# Altium project braking_io.PrjPcb (part 3 of 5)

## Sheet power_24V.SchDoc: Power 24V
size A4; Organization: Badgerloop Electrical; Address1: 133 Engineering Research Building; Address2: 1500 Engineering Drive; Address3: Madison, Wi 53706
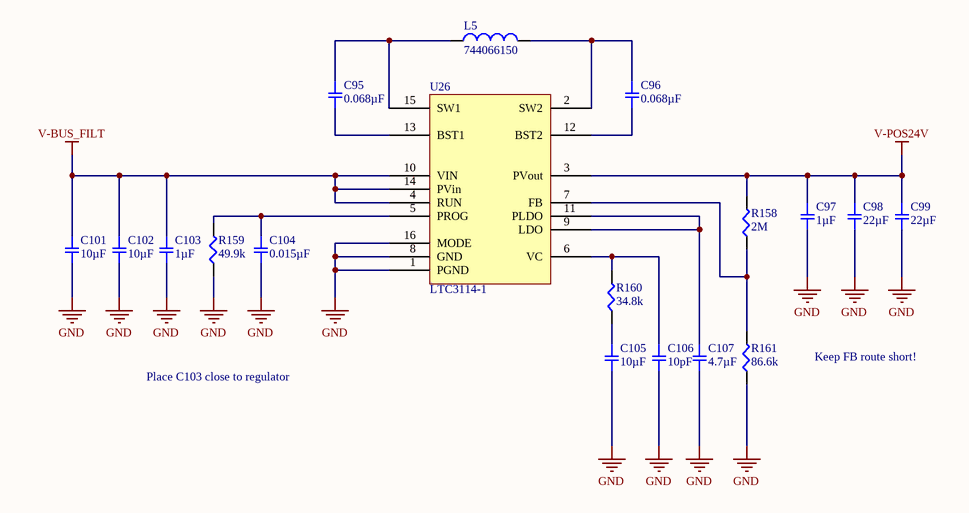
[diagram p5: power_24V.SchDoc]

### Parts
C95  0.068µF  [SMD-0805C]
C96  0.068µF  [SMD-0805C]
C97  1µF  [SMD-0805C]
C98  22µF  [SMD-1206C]
C99  22µF  [SMD-1206C]
C101  10µF  [SMD-1206C]
C102  10µF  [SMD-1206C]
C103  1µF  [SMD-1206C]
C104  0.015µF  [SMD-0805C]
C105  10µF  [SMD-1206C]
C106  10pF  [SMD-0805C]
C107  4.7µF  [SMD-1206C]
L5  744066150  [INDP100100X38N]
R158  2M  [SMD-0805-RES]
R159  49.9k  [SMD-0805-RES]
R160  34.8k  [SMD-0805-RES]
R161  86.6k  [SMD-0805-RES]
U26  LTC3114-1  [TSOP65P640X110_HS-17N]

### Nets
GND: C97.2 C98.2 C99.2 C101.2 C102.2 C103.2 C104.2 C105.2 C106.2 C107.2 R159.1 R161.1 U26.1(PGND) U26.8(GND) U26.16(MODE)
V-BUS_FILT: C101.1 C102.1 C103.1 U26.4(RUN) U26.10(VIN) U26.14(PVin)
V-POS24V: C97.1 C98.1 C99.1 R158.2 U26.3(PVout)
NetC95_1: C95.1 L5.1 U26.15(SW1)
NetC95_2: C95.2 U26.13(BST1)
NetC96_1: C96.1 L5.2 U26.2(SW2)
NetC96_2: C96.2 U26.12(BST2)
NetC104_1: C104.1 R159.2 U26.5(PROG)
NetC105_1: C105.1 R160.1
NetC106_1: C106.1 R160.2 U26.6(VC)
NetC107_1: C107.1 U26.9(LDO) U26.11(PLDO)
NetR158_1: R158.1 R161.2 U26.7(FB)

### Notes on the sheet
- Place C103 close to regulator
- Keep FB route short!
- Title
- Engineer:
- Date:
- Time:
- Revision:
- Sheet
- of
- File:

### Library data of the parts
C95 C96 = GCJ21BR71H683KA01L: CAP CER 0.068UF 50V X7R 0805; Manufacturer: Murata Electronics North America; Factory Stock: 0; Unit Price (USD): 0.24; Minimum Quantity: 1; Tolerance: ±10%; Datasheets: http://www.murata.com/~/media/webrenewal/support/library/catalog/products/capacitor/mlcc/c03e.ashx; Image: //media.digikey.com/Renders/Murata%20Renders/0805%20(2012%20Metric)%20.85mm.jpg; Digi-Key Part Number: 490-5807-1-ND; Part Number: GCJ21BR71H683KA01L; Quantity Available: 4490; @ qty: 0; Packaging: Cut Tape (CT); Series: GCJ; Part Status: Active; Value: 0.068µF; Voltage: 50V; Temperature Coefficient: X7R; Operating Temperature: -55°C ~ 125°C; Features: Soft Termination; Ratings: AEC-Q200; Applications: Automotive, Boardflex Sensitive; Mounting Type: Surface Mount, MLCC; Package / Case: 0805 (2012 Metric); Size / Dimension: 0.079" L x 0.049" W (2.00mm x 1.25mm); Height - Seated (Max): -; Thickness (Max): 0.057" (1.45mm); Lead Spacing: -; Lead Style: -
C97 = GCJ21BR71H105KA01L: CAP CER 1UF 50V X7R 0805; Manufacturer: Murata Electronics North America; Factory Stock: 0; Unit Price (USD): 0.33; Minimum Quantity: 1; Tolerance: ±10%; Datasheets: http://www.murata.com/~/media/webrenewal/support/library/catalog/products/capacitor/mlcc/c03e.ashx; Image: //media.digikey.com/Renders/Murata%20Renders/0805%20(2012%20Metric)%20.85mm.jpg; Digi-Key Part Number: 490-10667-1-ND; Part Number: GCJ21BR71H105KA01L; Quantity Available: 55137; @ qty: 0; Packaging: Cut Tape (CT); Series: GCJ; Part Status: Active; Value: 1µF; Voltage: 50V; Temperature Coefficient: X7R; Operating Temperature: -55°C ~ 125°C; Features: Soft Termination; Ratings: AEC-Q200; Applications: Automotive, Boardflex Sensitive; Mounting Type: Surface Mount, MLCC; Package / Case: 0805 (2012 Metric); Size / Dimension: 0.079" L x 0.049" W (2.00mm x 1.25mm); Height - Seated (Max): -; Thickness (Max): 0.057" (1.45mm); Lead Spacing: -; Lead Style: -
C98 C99 = GRM31CR61E226KE15L: CAP CER 22UF 25V X5R 1206; Manufacturer: Murata Electronics North America; Factory Stock: 0; Unit Price (USD): 0.56; Minimum Quantity: 1; Tolerance: ±10%; Datasheets: http://www.murata.com/~/media/webrenewal/support/library/catalog/products/capacitor/mlcc/c02e.pdf; Image: //media.digikey.com/Renders/Murata%20Renders/GR331BD72E473KW01L.jpg; Digi-Key Part Number: 490-5527-1-ND; Part Number: GRM31CR61E226KE15L; Quantity Available: 524412; @ qty: 0; Packaging: Cut Tape (CT); Series: GRM; Part Status: Active; Value: 22µF; Voltage: 25V; Temperature Coefficient: X5R; Operating Temperature: -55°C ~ 85°C; Features: -; Ratings: -; Applications: General Purpose; Mounting Type: Surface Mount, MLCC; Package / Case: 1206 (3216 Metric); Size / Dimension: 0.126" L x 0.063" W (3.20mm x 1.60mm); Height - Seated (Max): -; Thickness (Max): 0.071" (1.80mm); Lead Spacing: -; Lead Style: -
C101 C102 C105 = GRM31CR61H106KA12L: CAP CER 10UF 50V X5R 1206; Manufacturer: Murata Electronics North America; Factory Stock: 0; Unit Price (USD): 0.65; Minimum Quantity: 1; Tolerance: ±10%; Datasheets: http://www.murata.com/~/media/webrenewal/support/library/catalog/products/capacitor/mlcc/c02e.pdf; Image: //media.digikey.com/Renders/Murata%20Renders/GR331BD72E473KW01L.jpg; Digi-Key Part Number: 490-5961-1-ND; Part Number: GRM31CR61H106KA12L; Quantity Available: 86736; @ qty: 0; Packaging: Cut Tape (CT); Series: GRM; Part Status: Active; Value: 10µF; Voltage: 50V; Temperature Coefficient: X5R; Operating Temperature: -55°C ~ 85°C; Features: -; Ratings: -; Applications: General Purpose; Mounting Type: Surface Mount, MLCC; Package / Case: 1206 (3216 Metric); Size / Dimension: 0.126" L x 0.063" W (3.20mm x 1.60mm); Height - Seated (Max): -; Thickness (Max): 0.071" (1.80mm); Lead Spacing: -; Lead Style: -
C103 = GCJ31MR71H105KA12L: CAP CER 1UF 50V X7R 1206; Manufacturer: Murata Electronics North America; Factory Stock: 0; Unit Price (USD): 0.32; Minimum Quantity: 1; Tolerance: ±10%; Datasheets: http://www.murata.com/~/media/webrenewal/support/library/catalog/products/capacitor/mlcc/c03e.ashx; Image: //media.digikey.com/Renders/Murata%20Renders/GR331BD72E473KW01L.jpg; Digi-Key Part Number: 490-5810-1-ND; Part Number: GCJ31MR71H105KA12L; Quantity Available: 38710; @ qty: 0; Packaging: Cut Tape (CT); Series: GCJ; Part Status: Active; Value: 1µF; Voltage: 50V; Temperature Coefficient: X7R; Operating Temperature: -55°C ~ 125°C; Features: Soft Termination; Ratings: AEC-Q200; Applications: Automotive, Boardflex Sensitive; Mounting Type: Surface Mount, MLCC; Package / Case: 1206 (3216 Metric); Size / Dimension: 0.126" L x 0.063" W (3.20mm x 1.60mm); Height - Seated (Max): -; Thickness (Max): 0.053" (1.35mm); Lead Spacing: -; Lead Style: -
C104 = GC321AD72E153KX01D: CAP CER 0.015UF 250V X7T 0805; Manufacturer: Murata Electronics North America; Factory Stock: 0; Unit Price (USD): 0.27; Minimum Quantity: 1; Tolerance: ±10%; Datasheets: http://search.murata.co.jp/Ceramy/image/img/A01X/G101/ENG/GC321AD72E153KX01-01.pdf; Image: //media.digikey.com/Renders/Murata%20Renders/0805(GC3)200x125.jpg; Digi-Key Part Number: 490-13987-1-ND; Part Number: GC321AD72E153KX01D; Quantity Available: 4000; @ qty: 0; Packaging: Cut Tape (CT); Series: GC3; Part Status: Active; Value: 0.015µF; Voltage: 250V; Temperature Coefficient: X7T; Operating Temperature: -55°C ~ 125°C; Features: -; Ratings: AEC-Q200; Applications: Automotive; Mounting Type: Surface Mount, MLCC; Package / Case: 0805 (2012 Metric); Size / Dimension: 0.079" L x 0.049" W (2.00mm x 1.25mm); Height - Seated (Max): -; Thickness (Max): 0.039" (1.00mm); Lead Spacing: -; Lead Style: -
C106 = GQM2195C2A100GB01D: CAP CER 10PF 100V NP0 0805; Manufacturer: Murata Electronics North America; Factory Stock: 0; Unit Price (USD): 0.91; Minimum Quantity: 1; Tolerance: ±2%; Temperature Coefficient: C0G, NP0; Datasheets: http://www.murata.com/~/media/webrenewal/support/library/catalog/products/capacitor/mlcc/c02e.pdf; Image: //media.digikey.com/Renders/Murata%20Renders/0805(GxM9).jpg; Digi-Key Part Number: 490-6098-1-ND; Part Number: GQM2195C2A100GB01D; Quantity Available: 3211; @ qty: 0; Packaging: Cut Tape (CT); Series: GQM; Part Status: Active; Value: 10pF; Voltage: 100V; Operating Temperature: -55°C ~ 125°C; Features: High Q, Low Loss; Ratings: -; Applications: RF, Microwave, High Frequency; Mounting Type: Surface Mount, MLCC; Package / Case: 0805 (2012 Metric); Size / Dimension: 0.079" L x 0.049" W (2.00mm x 1.25mm); Height - Seated (Max): -; Thickness (Max): 0.037" (0.95mm); Lead Spacing: -; Lead Style: -
C107 = GCM31CC71H475KA03L: CAP CER 4.7UF 50V X7S 1206; Manufacturer: Murata Electronics North America; Factory Stock: 0; Unit Price (USD): 0.57; Minimum Quantity: 1; Tolerance: ±10%; Datasheets: http://www.murata.com/~/media/webrenewal/support/library/catalog/products/capacitor/mlcc/c03e.ashx; Image: //media.digikey.com/Renders/Murata%20Renders/GR331BD72E473KW01L.jpg; Digi-Key Part Number: 490-11167-1-ND; Part Number: GCM31CC71H475KA03L; Quantity Available: 11700; @ qty: 0; Packaging: Cut Tape (CT); Series: GCM; Part Status: Active; Value: 4.7µF; Voltage: 50V; Temperature Coefficient: X7S; Operating Temperature: -55°C ~ 125°C; Features: -; Ratings: AEC-Q200; Applications: Automotive; Mounting Type: Surface Mount, MLCC; Package / Case: 1206 (3216 Metric); Size / Dimension: 0.126" L x 0.063" W (3.20mm x 1.60mm); Height - Seated (Max): -; Thickness (Max): 0.071" (1.80mm); Lead Spacing: -; Lead Style: -
L5 = 744066150: FIXED IND 15UH 3.2A 50 MOHM SMD; Manufacturer: Wurth Electronics; Core Material: Ferrite; Saturation Current: 3.25A; Tolerance: 30%; Shielding: Shielded; Self Resonant Frequency: 16MHz; DC Resistance (DCR): 50mR; Test Frequency: 100kHz; Supplier 1: Digi-Key; Manufacturer Part Number: 744066150; Stock 1: 1755; Pricing 1: 1=1.94000, 10=1.88200, 50=1.64600, 100=1.50500 (USD); RoHS: Yes; Mount: Surface Mount; Case/Package: Nonstandard; Weight: 0.044904oz; Min Operating Temperature: -40°C; Max Operating Temperature: 125°C; Package Quantity: 800; Current Rating: 3.2A; Packaging: Cut Tape; Inductance Tolerance: 30%; Inductance: 15uH; Composition: Wirewound; Max DC Current: 3.2A; Termination: SMD/SMT; RMS Current (Irms): 3.2A; Series Resistance: 50mR; Length: 10mm; Height: 3.8mm; Width: 10mm; Height - Seated (Max): 0.161inch; Depth: 10mm; REACH SVHC: Unknown; Lead Free: Lead Free; ComponentLink1URL: https://datasheet.ciiva.com/1051/744066150-1051985.pdf?src-supplier=Digi-Key; ComponentLink1Description: https://datasheet.ciiva.com/1051/744066150-1051985.pdf?src-supplier=Digi-Key; ComponentLink2URL: https://datasheet.ciiva.com/7892/1735619-7892648.pdf?src-supplier=Element14; ComponentLink2Description: https://datasheet.ciiva.com/7892/1735619-7892648.pdf?src-supplier=Element14; ComponentLink3URL: https://datasheet.ciiva.com/11803/0900766b80febc54-11803273.pdf?src-supplier=RSComponents; ComponentLink3Description: https://datasheet.ciiva.com/11803/0900766b80febc54-11803273.pdf?src-supplier=RSComponents; ComponentLink4URL: https://datasheet.ciiva.com/13320/744066150-67363-13320654.pdf?src-supplier=Mouser; ComponentLink4Description: https://datasheet.ciiva.com/13320/744066150-67363-13320654.pdf?src-supplier=Mouser; ComponentLink5URL: https://datasheet.ciiva.com/1051/744066150-1051986.pdf?src-supplier=Digi-Key; ComponentLink5Description: https://datasheet.ciiva.com/1051/744066150-1051986.pdf?src-supplier=Digi-Key; ComponentLink6URL: https://datasheet.ciiva.com/1051/744066150-1051987.pdf?src-supplier=Digi-Key; ComponentLink6Description: https://datasheet.ciiva.com/1051/744066150-1051987.pdf?src-supplier=Digi-Key; ComponentLink7URL: https://datasheet.ciiva.com/14123/744066150-ch-ger-eng-ds-14123723.pdf?src-supplier=Distrelec; ComponentLink7Description: https://datasheet.ciiva.com/14123/744066150-ch-ger-eng-ds-14123723.pdf?src-supplier=Distrelec; Supplier Part Number 1: 732-1077-1-ND
R158 = ERJ-6ENF2004V: RES SMD 2M OHM 1% 1/8W 0805; Manufacturer: Panasonic Electronic Components; Factory Stock: 0; Unit Price (USD): 0.00729; @ qty: 1500; Minimum Quantity: 1; Power (Watts): 0.125W, 1/8W; Temperature Coefficient: ±100ppm/°C; Part Number: ERJ-6ENF2004V; Datasheets: http://industrial.panasonic.com/www-cgi/jvcr13pz.cgi?E+PZ+3+AOA0002+ERJ6ENF2004V+7+WW; Image: //media.digikey.com/Renders/Panasonic%20Renders/ERJ-0805%20Pkg.jpg; Digi-Key Part Number: P2.00MCCT-ND; Quantity Available: 31894; Packaging: Cut Tape (CT); Series: ERJ; Part Status: Active; Value: 2M; Tolerance: ±1%; Composition: Thick Film; Features: Automotive AEC-Q200; Operating Temperature: -55°C ~ 155°C; Package / Case: 0805 (2012 Metric); Supplier Device Package: 0805; Size / Dimension: 0.079" L x 0.049" W (2.00mm x 1.25mm); Height - Seated (Max): 0.028" (0.70mm); Number of Terminations: 2; Failure Rate: -
R159 = ERJ-6ENF4992V: RES SMD 49.9K OHM 1% 1/8W 0805; Manufacturer: Panasonic Electronic Components; Factory Stock: 0; Unit Price (USD): 0.00729; @ qty: 1500; Minimum Quantity: 1; Power (Watts): 0.125W, 1/8W; Temperature Coefficient: ±100ppm/°C; Part Number: ERJ-6ENF4992V; Datasheets: http://industrial.panasonic.com/www-cgi/jvcr13pz.cgi?E+PZ+3+AOA0002+ERJ6ENF4992V+7+WW; Image: //media.digikey.com/Renders/Panasonic%20Renders/ERJ-0805%20Pkg.jpg; Digi-Key Part Number: P49.9KCCT-ND; Quantity Available: 165139; Packaging: Cut Tape (CT); Series: ERJ; Part Status: Active; Value: 49.9k; Tolerance: ±1%; Composition: Thick Film; Features: Automotive AEC-Q200; Operating Temperature: -55°C ~ 155°C; Package / Case: 0805 (2012 Metric); Supplier Device Package: 0805; Size / Dimension: 0.079" L x 0.049" W (2.00mm x 1.25mm); Height - Seated (Max): 0.028" (0.70mm); Number of Terminations: 2; Failure Rate: -
R160 = ERJ-6ENF3482V: RES SMD 34.8K OHM 1% 1/8W 0805; Manufacturer: Panasonic Electronic Components; Factory Stock: 0; Unit Price (USD): 0.00729; @ qty: 1500; Minimum Quantity: 1; Power (Watts): 0.125W, 1/8W; Temperature Coefficient: ±100ppm/°C; Part Number: ERJ-6ENF3482V; Datasheets: http://industrial.panasonic.com/www-cgi/jvcr13pz.cgi?E+PZ+3+AOA0002+ERJ6ENF3482V+7+WW; Image: //media.digikey.com/Renders/Panasonic%20Renders/ERJ-0805%20Pkg.jpg; Digi-Key Part Number: P34.8KCCT-ND; Quantity Available: 31955; Packaging: Cut Tape (CT); Series: ERJ; Part Status: Active; Value: 34.8k; Tolerance: ±1%; Composition: Thick Film; Features: Automotive AEC-Q200; Operating Temperature: -55°C ~ 155°C; Package / Case: 0805 (2012 Metric); Supplier Device Package: 0805; Size / Dimension: 0.079" L x 0.049" W (2.00mm x 1.25mm); Height - Seated (Max): 0.028" (0.70mm); Number of Terminations: 2; Failure Rate: -
R161 = ERJ-6ENF8662V: RES SMD 86.6K OHM 1% 1/8W 0805; Manufacturer: Panasonic Electronic Components; Factory Stock: 0; Unit Price (USD): 0.00729; @ qty: 1500; Minimum Quantity: 1; Power (Watts): 0.125W, 1/8W; Temperature Coefficient: ±100ppm/°C; Part Number: ERJ-6ENF8662V; Datasheets: http://industrial.panasonic.com/www-cgi/jvcr13pz.cgi?E+PZ+3+AOA0002+ERJ6ENF8662V+7+WW; Image: //media.digikey.com/Renders/Panasonic%20Renders/ERJ-0805%20Pkg.jpg; Digi-Key Part Number: P86.6KCCT-ND; Quantity Available: 23872; Packaging: Cut Tape (CT); Series: ERJ; Part Status: Active; Value: 86.6k; Tolerance: ±1%; Composition: Thick Film; Features: Automotive AEC-Q200; Operating Temperature: -55°C ~ 155°C; Package / Case: 0805 (2012 Metric); Supplier Device Package: 0805; Size / Dimension: 0.079" L x 0.049" W (2.00mm x 1.25mm); Height - Seated (Max): 0.028" (0.70mm); Number of Terminations: 2; Failure Rate: -
U26 = LTC3114-1: Manufacturer: Analog Devices / Linear Technology; Manufacturer Part Number: LTC3114EFE-1#TRPBF; Number of Outputs: 1; Min Input Voltage: 2.2V; Max Input Voltage: 40V; Min Output Voltage: 2.7V; Output Current: 1A; Switching Frequency: 1.2MHz; Synchronous Rectifier: Yes; Efficiency: 96%; Topology: Buck-Boost; Output Type: Adjustable; Output Configuration: Positive; Supplier 1: Digi-Key; Stock 1: 2151; Pricing 1: 1=10.01000, 25=7.35000, 100=5.49400, 250=5.21932, 500=5.10160 (USD); RoHS: Yes; Mount: Surface Mount; Case/Package: TSSOP; Number of Pins: 16; Min Operating Temperature: -40°C; Max Operating Temperature: 125°C; Packaging: Tape and Reel; Max Output Voltage: 40V; Output Voltage: 2.7V; ComponentLink1URL: http://components.arrow.com/part/dataview/66446920S858405N7433?src-supplier=Arrow; ComponentLink1Description: http://components.arrow.com/part/dataview/66446920S858405N7433?src-supplier=Arrow; ComponentLink2URL: http://www.linear.com/docs/44756?src-supplier=Digi-Key; ComponentLink2Description: http://www.linear.com/docs/44756?src-supplier=Digi-Key; Supplier Part Number 1: LTC3114EFE-1#TRPBFCT-ND

## Sheet solenoid.SchDoc: Solenoids
size A4; Organization: Badgerloop Electrical; Address1: 133 Engineering Research Building; Address2: 1500 Engineering Drive; Address3: Madison, Wi 53706
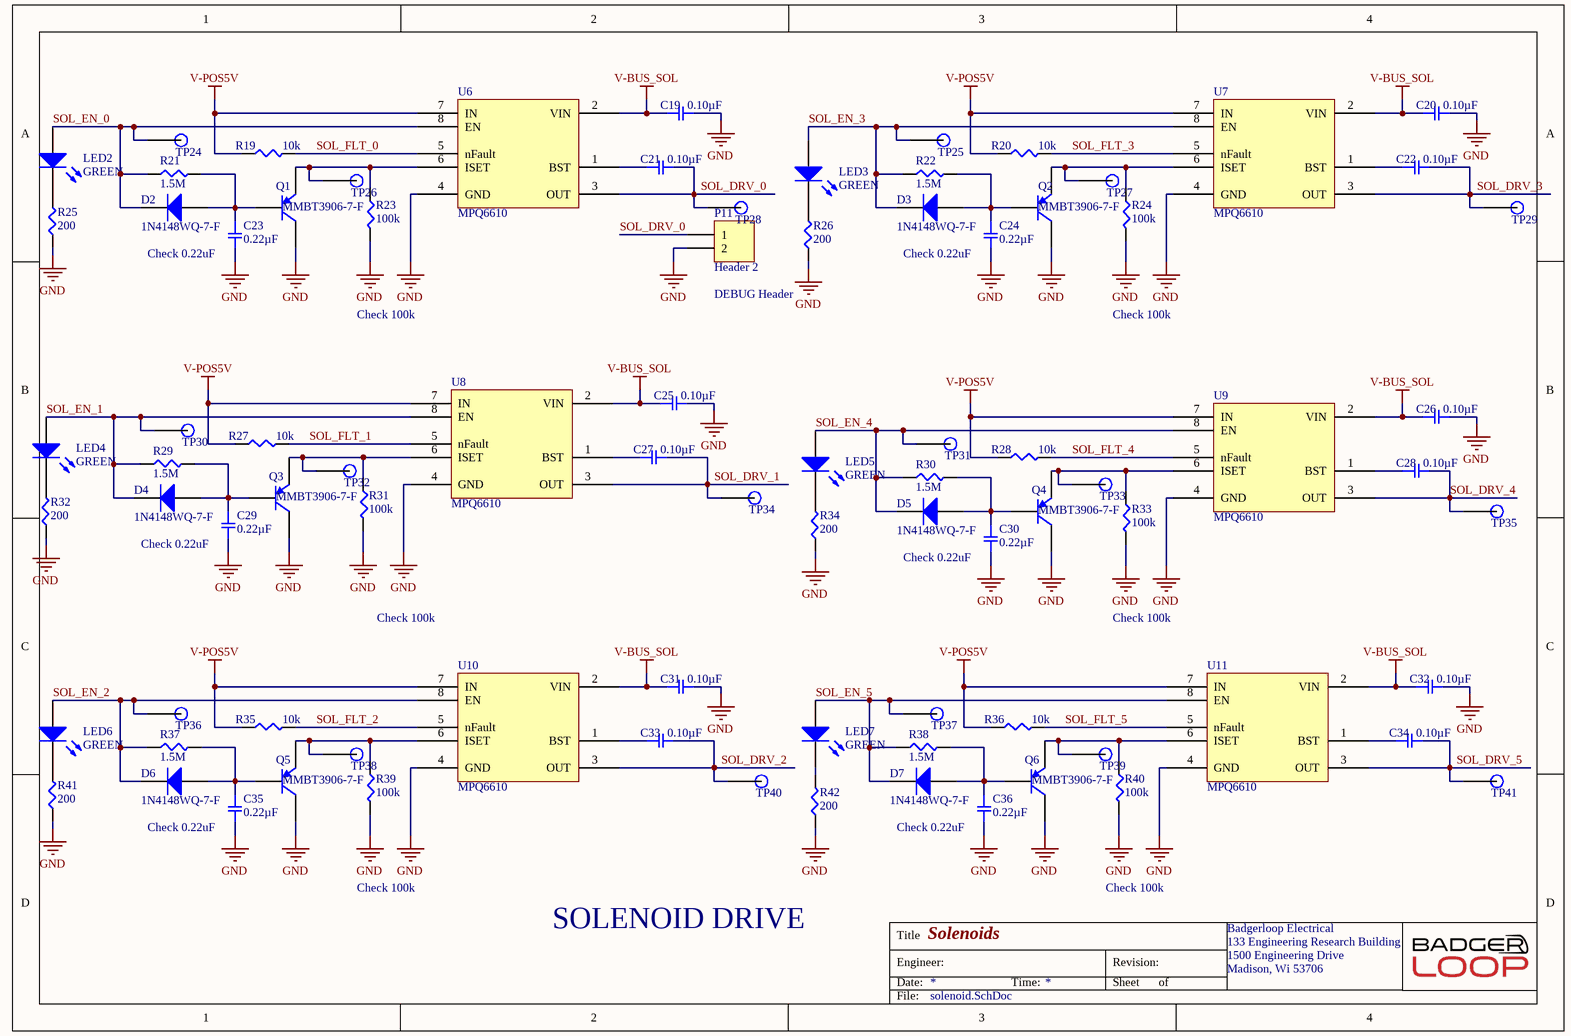
[diagram p6: solenoid.SchDoc]

### Parts
C19  0.10µF  [SMD-0805C]
C20  0.10µF  [SMD-0805C]
C21  0.10µF  [SMD-0805C]
C22  0.10µF  [SMD-0805C]
C23  0.22µF  [SMD-0805C]
C24  0.22µF  [SMD-0805C]
C25  0.10µF  [SMD-0805C]
C26  0.10µF  [SMD-0805C]
C27  0.10µF  [SMD-0805C]
C28  0.10µF  [SMD-0805C]
C29  0.22µF  [SMD-0805C]
C30  0.22µF  [SMD-0805C]
C31  0.10µF  [SMD-0805C]
C32  0.10µF  [SMD-0805C]
C33  0.10µF  [SMD-0805C]
C34  0.10µF  [SMD-0805C]
C35  0.22µF  [SMD-0805C]
C36  0.22µF  [SMD-0805C]
D2  1N4148WQ-7-F  [INDM3838X18N]
D3  1N4148WQ-7-F  [INDM3838X18N]
D4  1N4148WQ-7-F  [INDM3838X18N]
D5  1N4148WQ-7-F  [INDM3838X18N]
D6  1N4148WQ-7-F  [INDM3838X18N]
D7  1N4148WQ-7-F  [INDM3838X18N]
LED2  GREEN  [LED 0603 GREEN]
LED3  GREEN  [LED 0603 GREEN]
LED4  GREEN  [LED 0603 GREEN]
LED5  GREEN  [LED 0603 GREEN]
LED6  GREEN  [LED 0603 GREEN]
LED7  GREEN  [LED 0603 GREEN]
P11  Header 2  [Pin Header 1x2 TH Pitch 2.54mm]
Q1  MMBT3906-7-F  [SOTFL103P240X110-3N]
Q2  MMBT3906-7-F  [SOTFL103P240X110-3N]
Q3  MMBT3906-7-F  [SOTFL103P240X110-3N]
Q4  MMBT3906-7-F  [SOTFL103P240X110-3N]
Q5  MMBT3906-7-F  [SOTFL103P240X110-3N]
Q6  MMBT3906-7-F  [SOTFL103P240X110-3N]
R19  10k  [SMD-0805-RES]
R20  10k  [SMD-0805-RES]
R21  1.5M  [SMD-0805-RES]
R22  1.5M  [SMD-0805-RES]
R23  100k  [SMD-0805-RES]
R24  100k  [SMD-0805-RES]
R25  200  [SMD-0805-RES]
R26  200  [SMD-0805-RES]
R27  10k  [SMD-0805-RES]
R28  10k  [SMD-0805-RES]
R29  1.5M  [SMD-0805-RES]
R30  1.5M  [SMD-0805-RES]
R31  100k  [SMD-0805-RES]
R32  200  [SMD-0805-RES]
R33  100k  [SMD-0805-RES]
R34  200  [SMD-0805-RES]
R35  10k  [SMD-0805-RES]
R36  10k  [SMD-0805-RES]
R37  1.5M  [SMD-0805-RES]
R38  1.5M  [SMD-0805-RES]
R39  100k  [SMD-0805-RES]
R40  100k  [SMD-0805-RES]
R41  200  [SMD-0805-RES]
R42  200  [SMD-0805-RES]
TP24  TP  [Test Point]  (value not drawn)
TP25  TP  [Test Point]  (value not drawn)
TP26  TP  [Test Point]  (value not drawn)
TP27  TP  [Test Point]  (value not drawn)
TP28  TP  [Test Point]  (value not drawn)
TP29  TP  [Test Point]  (value not drawn)
TP30  TP  [Test Point]  (value not drawn)
TP31  TP  [Test Point]  (value not drawn)
TP32  TP  [Test Point]  (value not drawn)
TP33  TP  [Test Point]  (value not drawn)
TP34  TP  [Test Point]  (value not drawn)
TP35  TP  [Test Point]  (value not drawn)
TP36  TP  [Test Point]  (value not drawn)
TP37  TP  [Test Point]  (value not drawn)
TP38  TP  [Test Point]  (value not drawn)
TP39  TP  [Test Point]  (value not drawn)
TP40  TP  [Test Point]  (value not drawn)
TP41  TP  [Test Point]  (value not drawn)
U6  MPQ6610  [SOP127P600X175-8N]
U7  MPQ6610  [SOP127P600X175-8N]
U8  MPQ6610  [SOP127P600X175-8N]
U9  MPQ6610  [SOP127P600X175-8N]
U10  MPQ6610  [SOP127P600X175-8N]
U11  MPQ6610  [SOP127P600X175-8N]

### Nets
GND: C19.2 C20.2 C23.2 C24.2 C25.2 C26.2 C29.2 C30.2 C31.2 C32.2 C35.2 C36.2 P11.2 Q1.3(C) Q2.3(C) Q3.3(C) Q4.3(C) Q5.3(C) Q6.3(C) R23.2 R24.2 R25.1 R26.1 R31.2 R32.1 R33.2 R34.1 R39.2 R40.2 R41.1 R42.1 U6.4(GND) U7.4(GND) U8.4(GND) U9.4(GND) U10.4(GND) U11.4(GND)
V-BUS_SOL: C19.1 C20.1 C25.1 C26.1 C31.1 C32.1 U6.2(VIN) U7.2(VIN) U8.2(VIN) U9.2(VIN) U10.2(VIN) U11.2(VIN)
V-POS5V: R19.1 R20.1 R27.1 R28.1 R35.1 R36.1 U6.7(IN) U7.7(IN) U8.7(IN) U9.7(IN) U10.7(IN) U11.7(IN)
SOL_DRV_0: C21.2 P11.1 TP28.1 U6.3(OUT)
SOL_DRV_1: C27.2 TP34.1 U8.3(OUT)
SOL_DRV_2: C33.2 TP40.1 U10.3(OUT)
SOL_DRV_3: C22.2 TP29.1 U7.3(OUT)
SOL_DRV_4: C28.2 TP35.1 U9.3(OUT)
SOL_DRV_5: C34.2 TP41.1 U11.3(OUT)
SOL_EN_0: D2.2(K) LED2.1(A) R21.1 TP24.1 U6.8(EN)
SOL_EN_1: D4.2(K) LED4.1(A) R29.1 TP30.1 U8.8(EN)
SOL_EN_2: D6.2(K) LED6.1(A) R37.1 TP36.1 U10.8(EN)
SOL_EN_3: D3.2(K) LED3.1(A) R22.1 TP25.1 U7.8(EN)
SOL_EN_4: D5.2(K) LED5.1(A) R30.1 TP31.1 U9.8(EN)
SOL_EN_5: D7.2(K) LED7.1(A) R38.1 TP37.1 U11.8(EN)
SOL_FLT_0: R19.2 U6.5(nFault)
SOL_FLT_1: R27.2 U8.5(nFault)
SOL_FLT_2: R35.2 U10.5(nFault)
SOL_FLT_3: R20.2 U7.5(nFault)
SOL_FLT_4: R28.2 U9.5(nFault)
SOL_FLT_5: R36.2 U11.5(nFault)
NetC21_1: C21.1 U6.1(BST)
NetC22_1: C22.1 U7.1(BST)
NetC23_1: C23.1 D2.1(A) Q1.1(B) R21.2
NetC24_1: C24.1 D3.1(A) Q2.1(B) R22.2
NetC27_1: C27.1 U8.1(BST)
NetC28_1: C28.1 U9.1(BST)
NetC29_1: C29.1 D4.1(A) Q3.1(B) R29.2
NetC30_1: C30.1 D5.1(A) Q4.1(B) R30.2
NetC33_1: C33.1 U10.1(BST)
NetC34_1: C34.1 U11.1(BST)
NetC35_1: C35.1 D6.1(A) Q5.1(B) R37.2
NetC36_1: C36.1 D7.1(A) Q6.1(B) R38.2
NetLED2_2: LED2.2(K) R25.2
NetLED3_2: LED3.2(K) R26.2
NetLED4_2: LED4.2(K) R32.2
NetLED5_2: LED5.2(K) R34.2
NetLED6_2: LED6.2(K) R41.2
NetLED7_2: LED7.2(K) R42.2
NetQ1_2: Q1.2(E) R23.1 TP26.1 U6.6(ISET)
NetQ2_2: Q2.2(E) R24.1 TP27.1 U7.6(ISET)
NetQ3_2: Q3.2(E) R31.1 TP32.1 U8.6(ISET)
NetQ4_2: Q4.2(E) R33.1 TP33.1 U9.6(ISET)
NetQ5_2: Q5.2(E) R39.1 TP38.1 U10.6(ISET)
NetQ6_2: Q6.2(E) R40.1 TP39.1 U11.6(ISET)

### Notes on the sheet
- (near C23) Check 0.22uF
- DEBUG Header
- (near C24) Check 0.22uF
- Check 100k
- (near C29) Check 0.22uF
- (near C30) Check 0.22uF
- (near C35) Check 0.22uF
- (near C36) Check 0.22uF
- SOLENOID DRIVE
- Title
- Engineer:
- Date:
- Time:
- Revision:
- Sheet
- of
- File:

### Library data of the parts
C19-C22 C25-C28 C31-C34 = GRM21B7U1A104JA01L: CAP CER 0.1UF 10V U2J 0805; Manufacturer: Murata Electronics North America; Factory Stock: 0; Unit Price (USD): 0.4; Minimum Quantity: 1; Tolerance: ±5%; Datasheets: http://www.murata.com/~/media/webrenewal/support/library/catalog/products/capacitor/mlcc/c02e.pdf; Image: //media.digikey.com/Renders/Murata%20Renders/0805%20(2012%20Metric)%20.85mm.jpg; Digi-Key Part Number: 490-11592-1-ND; Part Number: GRM21B7U1A104JA01L; Quantity Available: 3390; @ qty: 0; Packaging: Cut Tape (CT); Series: GRM; Part Status: Active; Value: 0.10µF; Voltage: 10V; Temperature Coefficient: U2J; Operating Temperature: -55°C ~ 125°C; Features: -; Ratings: -; Applications: General Purpose; Mounting Type: Surface Mount, MLCC; Package / Case: 0805 (2012 Metric); Size / Dimension: 0.079" L x 0.049" W (2.00mm x 1.25mm); Height - Seated (Max): -; Thickness (Max): 0.053" (1.35mm); Lead Spacing: -; Lead Style: -
C23 C24 C29 C30 C35 C36 = LLA215R71A224MA14L: CAP CER 0.22UF 10V X7R 0805; Manufacturer: Murata Electronics North America; Factory Stock: 0; Unit Price (USD): 0.36; Minimum Quantity: 1; Tolerance: ±20%; Datasheets: http://www.murata.com/~/media/webrenewal/support/library/catalog/products/capacitor/mlcc/c02e.pdf; Image: //media.digikey.com/Renders/Murata%20Renders/0805-LLA.jpg; Digi-Key Part Number: 490-4432-1-ND; Part Number: LLA215R71A224MA14L; Quantity Available: 9914; @ qty: 0; Packaging: Cut Tape (CT); Series: LLA; Part Status: Active; Value: 0.22µF; Voltage: 10V; Temperature Coefficient: X7R; Operating Temperature: -55°C ~ 125°C; Features: Low ESL (Multi-Terminal); Ratings: -; Applications: Bypass, Decoupling; Mounting Type: Surface Mount, MLCC; Package / Case: 0805 (2012 Metric); Size / Dimension: 0.079" L x 0.049" W (2.00mm x 1.25mm); Height - Seated (Max): -; Thickness (Max): 0.022" (0.55mm); Lead Spacing: -; Lead Style: -
D2-D7 = 1N4148WQ-7-F: Diodes - General Purpose, Power, Switching SMT Fast Switching Diode; Manufacturer: Diodes Inc.; Digikey Link: https://www.digikey.com/product-detail/en/diodes-incorporated/1N4148WQ-7-F/1N4148WQ-7-FDITR-ND/8136126; Manufacturer P/N: 1N4148WQ-7-F; Digikey P/N: 1N4148WQ-7-FDITR-ND
LED2-LED7 = LED GREEN 0603: Manufacturer: Lite-On Inc.; Manufacturer P/N: LTST-C190KGKT; Digikey P/N: 160-1435-1-ND; Package / Case: 0603; Color: GREEN
P11 = Header 2: Header, 2-Pin; LatestRevisionDate: 17-Jul-2002; LatestRevisionNote: Re-released for DXP Platform.; Publisher: Altium Limited
Q1-Q6 = MMBT3906-7-F: Manufacturer: Diodes Zetex; Collector Emitter Voltage (VCEO): 40V; Max Power Dissipation: 300mW; Polarity: PNP; Max Collector Current: 200mA; hFE Min: 100; Number of Elements: 1; Frequency: 250MHz; Emitter Base Voltage (VEBO): 6V; Collector Emitter Saturation Voltage: -400mV; Element Configuration: Single; Continuous Collector Current: -200mA; Voltage Rating (DC): -40V; Supplier 1: Digi-Key; Manufacturer Part Number: MMBT3906-7-F; Stock 1: 687580; Pricing 1: 1=0.12000, 10=0.11400, 100=0.06190, 500=0.03806, 1000=0.02596 (USD); RoHS: Yes; Mount: Surface Mount; Case/Package: SOT-23; Number of Pins: 3; Weight: 0.000282oz; Contact Plating: Tin,Matte; Min Operating Temperature: -55°C; Max Operating Temperature: 150°C; Packaging: Tape and Reel; Package Quantity: 3000; Transition Frequency: 250MHz; Collector Emitter Breakdown Voltage: 40V; Max Breakdown Voltage: 40V; Collector Base Voltage (VCBO): 40V; Power Dissipation: 300mW; Max Frequency: 250MHz; Gain Bandwidth Product: 250MHz; Current Rating: -200mA; Length: 3.05mm; Height: 1mm; Width: 1.4mm; Radiation Hardening: No; REACH SVHC: No SVHC; Lead Free: Lead Free; ComponentLink1URL: https://datasheet.ciiva.com/27052/1540746-27052408.pdf?src-supplier=Jameco; ComponentLink1Description: https://datasheet.ciiva.com/27052/1540746-27052408.pdf?src-supplier=Jameco; ComponentLink2URL: https://datasheet.ciiva.com/15139/getdatasheetpartid-255292-15139821.pdf?src-supplier=Verical; ComponentLink2Description: https://datasheet.ciiva.com/15139/getdatasheetpartid-255292-15139821.pdf?src-supplier=Verical
R19 R20 R27 R28 R35 R36 = ERJ-P06J103V: RES SMD 10K OHM 5% 1/2W 0805; Manufacturer: Panasonic Electronic Components; Factory Stock: 0; Unit Price (USD): 0.01839; @ qty: 1500; Minimum Quantity: 1; Power (Watts): 0.5W, 1/2W; Temperature Coefficient: ±200ppm/°C; Part Number: ERJ-P06J103V; Datasheets: https://industrial.panasonic.com/cdbs/www-data/pdf/RDA0000/AOA0000C243.pdf; Image: //media.digikey.com/Renders/Panasonic%20Renders/ERJ-0805%20Pkg.jpg; Digi-Key Part Number: P10KADCT-ND; Quantity Available: 413576; Packaging: Cut Tape (CT); Series: ERJ; Part Status: Active; Value: 10k; Tolerance: ±5%; Composition: Thick Film; Features: Automotive AEC-Q200, Pulse Withstanding; Operating Temperature: -55°C ~ 155°C; Package / Case: 0805 (2012 Metric); Supplier Device Package: 0805; Size / Dimension: 0.079" L x 0.049" W (2.00mm x 1.25mm); Height - Seated (Max): 0.028" (0.70mm); Number of Terminations: 2; Failure Rate: -
R21 R22 R29 R30 R37 R38 = ERJ-6GEYJ155V: RES SMD 1.5M OHM 5% 1/8W 0805; Manufacturer: Panasonic Electronic Components; Factory Stock: 0; Unit Price (USD): 0.00496; @ qty: 1500; Minimum Quantity: 1; Power (Watts): 0.125W, 1/8W; Temperature Coefficient: -400/ +150ppm/°C; Part Number: ERJ-6GEYJ155V; Datasheets: http://industrial.panasonic.com/www-cgi/jvcr13pz.cgi?E+PZ+3+AOA0001+ERJ6GEYJ155V+7+WW; Image: //media.digikey.com/Renders/Panasonic%20Renders/ERJ-0805%20Pkg.jpg; Digi-Key Part Number: P1.5MACT-ND; Quantity Available: 51728; Packaging: Cut Tape (CT); Series: ERJ; Part Status: Active; Value: 1.5M; Tolerance: ±5%; Composition: Thick Film; Features: Automotive AEC-Q200; Operating Temperature: -55°C ~ 155°C; Package / Case: 0805 (2012 Metric); Supplier Device Package: 0805; Size / Dimension: 0.079" L x 0.049" W (2.00mm x 1.25mm); Height - Seated (Max): 0.028" (0.70mm); Number of Terminations: 2; Failure Rate: -
R23 R24 R31 R33 R39 R40 = ERJ-P06J104V: RES SMD 100K OHM 5% 1/2W 0805; Manufacturer: Panasonic Electronic Components; Factory Stock: 0; Unit Price (USD): 0.01839; @ qty: 1500; Minimum Quantity: 1; Power (Watts): 0.5W, 1/2W; Temperature Coefficient: ±200ppm/°C; Part Number: ERJ-P06J104V; Datasheets: https://industrial.panasonic.com/cdbs/www-data/pdf/RDA0000/AOA0000C243.pdf; Image: //media.digikey.com/Renders/Panasonic%20Renders/ERJ-0805%20Pkg.jpg; Digi-Key Part Number: P100KADCT-ND; Quantity Available: 82264; Packaging: Cut Tape (CT); Series: ERJ; Part Status: Active; Value: 100k; Tolerance: ±5%; Composition: Thick Film; Features: Automotive AEC-Q200, Pulse Withstanding; Operating Temperature: -55°C ~ 155°C; Package / Case: 0805 (2012 Metric); Supplier Device Package: 0805; Size / Dimension: 0.079" L x 0.049" W (2.00mm x 1.25mm); Height - Seated (Max): 0.028" (0.70mm); Number of Terminations: 2; Failure Rate: -
R25 R26 R32 R34 R41 R42 = ERJ-P06F2000V: RES SMD 200 OHM 1% 1/2W 0805; Manufacturer: Panasonic Electronic Components; Factory Stock: 0; Unit Price (USD): 0.02534; @ qty: 1500; Minimum Quantity: 1; Power (Watts): 0.5W, 1/2W; Temperature Coefficient: ±100ppm/°C; Part Number: ERJ-P06F2000V; Datasheets: https://industrial.panasonic.com/cdbs/www-data/pdf/RDA0000/AOA0000C243.pdf; Image: //media.digikey.com/Renders/Panasonic%20Renders/ERJ-0805%20Pkg.jpg; Digi-Key Part Number: P16064CT-ND; Quantity Available: 14258; Packaging: Cut Tape (CT); Series: ERJ; Part Status: Active; Value: 200; Tolerance: ±1%; Composition: Thick Film; Features: Automotive AEC-Q200, Pulse Withstanding; Operating Temperature: -55°C ~ 155°C; Package / Case: 0805 (2012 Metric); Supplier Device Package: 0805; Size / Dimension: 0.079" L x 0.049" W (2.00mm x 1.25mm); Height - Seated (Max): 0.028" (0.70mm); Number of Terminations: 2; Failure Rate: -
TP24-TP41 = TP: SMD TEST POINT

## Sheet solenoid_drv.SchDoc: Solenoid Control
size A4; Organization: Badgerloop Electrical; Address1: 133 Engineering Research Building; Address2: 1500 Engineering Drive; Address3: Madison, Wi 53706
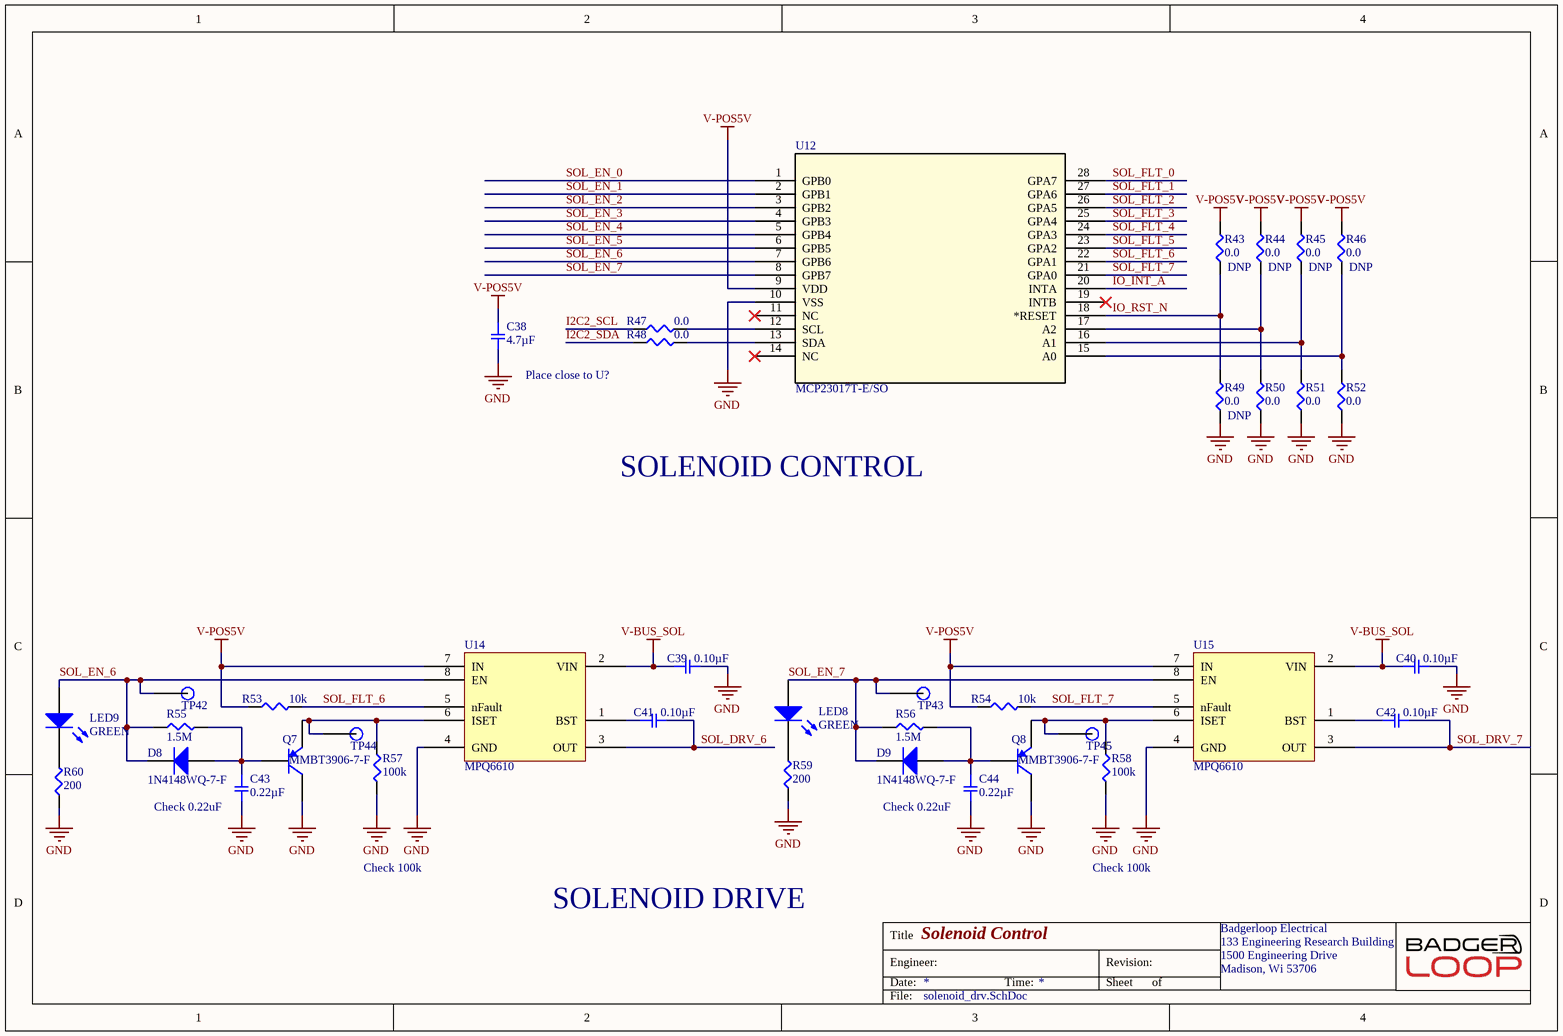
[diagram p7: solenoid_drv.SchDoc]

### Parts
C38  4.7µF  [SMD-0805C]
C39  0.10µF  [SMD-0805C]
C40  0.10µF  [SMD-0805C]
C41  0.10µF  [SMD-0805C]
C42  0.10µF  [SMD-0805C]
C43  0.22µF  [SMD-0805C]
C44  0.22µF  [SMD-0805C]
D8  1N4148WQ-7-F  [INDM3838X18N]
D9  1N4148WQ-7-F  [INDM3838X18N]
LED8  GREEN  [LED 0603 GREEN]
LED9  GREEN  [LED 0603 GREEN]
Q7  MMBT3906-7-F  [SOTFL103P240X110-3N]
Q8  MMBT3906-7-F  [SOTFL103P240X110-3N]
R43  0.0  [SMD-0805-RES]
R44  0.0  [SMD-0805-RES]
R45  0.0  [SMD-0805-RES]
R46  0.0  [SMD-0805-RES]
R47  0.0  [SMD-0805-RES]
R48  0.0  [SMD-0805-RES]
R49  0.0  [SMD-0805-RES]
R50  0.0  [SMD-0805-RES]
R51  0.0  [SMD-0805-RES]
R52  0.0  [SMD-0805-RES]
R53  10k  [SMD-0805-RES]
R54  10k  [SMD-0805-RES]
R55  1.5M  [SMD-0805-RES]
R56  1.5M  [SMD-0805-RES]
R57  100k  [SMD-0805-RES]
R58  100k  [SMD-0805-RES]
R59  200  [SMD-0805-RES]
R60  200  [SMD-0805-RES]
TP42  TP  [Test Point]  (value not drawn)
TP43  TP  [Test Point]  (value not drawn)
TP44  TP  [Test Point]  (value not drawn)
TP45  TP  [Test Point]  (value not drawn)
U12  MCP23017T-E/SO  [SOIC28-W_MC-M]
U14  MPQ6610  [SOP127P600X175-8N]
U15  MPQ6610  [SOP127P600X175-8N]

### Nets
GND: C38.2 C39.2 C40.2 C43.2 C44.2 Q7.3(C) Q8.3(C) R49.1 R50.1 R51.1 R52.1 R57.2 R58.2 R59.1 R60.1 U12.10(VSS) U14.4(GND) U15.4(GND)
V-BUS_SOL: C39.1 C40.1 U14.2(VIN) U15.2(VIN)
V-POS5V: C38.1 R43.2 R44.2 R45.2 R46.2 R53.1 R54.1 U12.9(VDD) U14.7(IN) U15.7(IN)
I2C2_SCL: R47.1
I2C2_SDA: R48.1
IO_INT_A: U12.20(INTA)
IO_RST_N: R43.1 R49.2 U12.18(*RESET)
SOL_DRV_6: C41.2 U14.3(OUT)
SOL_DRV_7: C42.2 U15.3(OUT)
SOL_EN_0: U12.1(GPB0)
SOL_EN_1: U12.2(GPB1)
SOL_EN_2: U12.3(GPB2)
SOL_EN_3: U12.4(GPB3)
SOL_EN_4: U12.5(GPB4)
SOL_EN_5: U12.6(GPB5)
SOL_EN_6: D8.2(K) LED9.1(A) R55.1 TP42.1 U12.7(GPB6) U14.8(EN)
SOL_EN_7: D9.2(K) LED8.1(A) R56.1 TP43.1 U12.8(GPB7) U15.8(EN)
SOL_FLT_0: U12.28(GPA7)
SOL_FLT_1: U12.27(GPA6)
SOL_FLT_2: U12.26(GPA5)
SOL_FLT_3: U12.25(GPA4)
SOL_FLT_4: U12.24(GPA3)
SOL_FLT_5: U12.23(GPA2)
SOL_FLT_6: R53.2 U12.22(GPA1) U14.5(nFault)
SOL_FLT_7: R54.2 U12.21(GPA0) U15.5(nFault)
NetC41_1: C41.1 U14.1(BST)
NetC42_1: C42.1 U15.1(BST)
NetC43_1: C43.1 D8.1(A) Q7.1(B) R55.2
NetC44_1: C44.1 D9.1(A) Q8.1(B) R56.2
NetLED8_2: LED8.2(K) R59.2
NetLED9_2: LED9.2(K) R60.2
NetQ7_2: Q7.2(E) R57.1 TP44.1 U14.6(ISET)
NetQ8_2: Q8.2(E) R58.1 TP45.1 U15.6(ISET)
NetR44_1: R44.1 R50.2 U12.17(A2)
NetR45_1: R45.1 R51.2 U12.16(A1)
NetR46_1: R46.1 R52.2 U12.15(A0)
NetR47_2: R47.2 U12.12(SCL)
NetR48_2: R48.2 U12.13(SDA)

Not connected (* = marked no-connect by the designer): U12 11(NC)* 14(NC)* 19(INTB)*

### Notes on the sheet
- Place close to U?
- SOLENOID CONTROL
- (near C43) Check 0.22uF
- (near C44) Check 0.22uF
- Check 100k
- SOLENOID DRIVE
- Title
- Engineer:
- Date:
- Time:
- Revision:
- Sheet
- of
- File:

### Library data of the parts
C38 = GRM21BR60J475KA11L: CAP CER 4.7UF 6.3V X5R 0805; Manufacturer: Murata Electronics North America; Factory Stock: 0; Unit Price (USD): 0.28; Minimum Quantity: 1; Tolerance: ±10%; Datasheets: http://www.murata.com/~/media/webrenewal/support/library/catalog/products/capacitor/mlcc/c02e.pdf; Image: //media.digikey.com/Renders/Murata%20Renders/0805%20(2012%20Metric)%20.85mm.jpg; Digi-Key Part Number: 490-9749-1-ND; Part Number: GRM21BR60J475KA11L; Quantity Available: 2821; @ qty: 0; Packaging: Cut Tape (CT); Series: GRM; Part Status: Active; Value: 4.7µF; Voltage: 6.3V; Temperature Coefficient: X5R; Operating Temperature: -55°C ~ 85°C; Features: -; Ratings: -; Applications: General Purpose; Mounting Type: Surface Mount, MLCC; Package / Case: 0805 (2012 Metric); Size / Dimension: 0.079" L x 0.049" W (2.00mm x 1.25mm); Height - Seated (Max): -; Thickness (Max): 0.055" (1.40mm); Lead Spacing: -; Lead Style: -
C39-C42 = GRM21B7U1A104JA01L: as C19 on sheet solenoid; Datasheets: http://www.murata.com/~/media/webrenewal/support/library/catalog/products/capacitor/mlcc/c02e.pdf; Image: //media.digikey.com/Renders/Murata%20Renders/0805%20(2012%20Metric)%20.85mm.jpg; Digi-Key Part Number: 490-11592-1-ND; Part Number: GRM21B7U1A104JA01L; Quantity Available: 3390; @ qty: 0; Packaging: Cut Tape (CT); Series: GRM; Part Status: Active; Value: 0.10µF; Voltage: 10V; Temperature Coefficient: U2J; Operating Temperature: -55°C ~ 125°C; Features: -; Ratings: -; Applications: General Purpose; Mounting Type: Surface Mount, MLCC; Package / Case: 0805 (2012 Metric); Size / Dimension: 0.079" L x 0.049" W (2.00mm x 1.25mm); Height - Seated (Max): -; Thickness (Max): 0.053" (1.35mm); Lead Spacing: -; Lead Style: -
C43 C44 = LLA215R71A224MA14L: as C23 on sheet solenoid; Datasheets: http://www.murata.com/~/media/webrenewal/support/library/catalog/products/capacitor/mlcc/c02e.pdf; Image: //media.digikey.com/Renders/Murata%20Renders/0805-LLA.jpg; Digi-Key Part Number: 490-4432-1-ND; Part Number: LLA215R71A224MA14L; Quantity Available: 9914; @ qty: 0; Packaging: Cut Tape (CT); Series: LLA; Part Status: Active; Value: 0.22µF; Voltage: 10V; Temperature Coefficient: X7R; Operating Temperature: -55°C ~ 125°C; Features: Low ESL (Multi-Terminal); Ratings: -; Applications: Bypass, Decoupling; Mounting Type: Surface Mount, MLCC; Package / Case: 0805 (2012 Metric); Size / Dimension: 0.079" L x 0.049" W (2.00mm x 1.25mm); Height - Seated (Max): -; Thickness (Max): 0.022" (0.55mm); Lead Spacing: -; Lead Style: -
D8 D9 = 1N4148WQ-7-F: as D2 on sheet solenoid; Digikey Link: https://www.digikey.com/product-detail/en/diodes-incorporated/1N4148WQ-7-F/1N4148WQ-7-FDITR-ND/8136126; Manufacturer P/N: 1N4148WQ-7-F; Digikey P/N: 1N4148WQ-7-FDITR-ND
LED8 LED9 = LED GREEN 0603: as LED2 on sheet solenoid; Digikey P/N: 160-1435-1-ND; Package / Case: 0603; Color: GREEN
Q7 Q8 = MMBT3906-7-F: as Q1 on sheet solenoid; Supplier 1: Digi-Key; Manufacturer Part Number: MMBT3906-7-F; Stock 1: 687580; Pricing 1: 1=0.12000, 10=0.11400, 100=0.06190, 500=0.03806, 1000=0.02596 (USD); RoHS: Yes; Mount: Surface Mount; Case/Package: SOT-23; Number of Pins: 3; Weight: 0.000282oz; Contact Plating: Tin,Matte; Min Operating Temperature: -55°C; Max Operating Temperature: 150°C; Packaging: Tape and Reel; Package Quantity: 3000; Transition Frequency: 250MHz; Collector Emitter Breakdown Voltage: 40V; Max Breakdown Voltage: 40V; Collector Base Voltage (VCBO): 40V; Power Dissipation: 300mW; Max Frequency: 250MHz; Gain Bandwidth Product: 250MHz; Current Rating: -200mA; Length: 3.05mm; Height: 1mm; Width: 1.4mm; Radiation Hardening: No; REACH SVHC: No SVHC; Lead Free: Lead Free; ComponentLink1URL: https://datasheet.ciiva.com/27052/1540746-27052408.pdf?src-supplier=Jameco; ComponentLink1Description: https://datasheet.ciiva.com/27052/1540746-27052408.pdf?src-supplier=Jameco; ComponentLink2URL: https://datasheet.ciiva.com/15139/getdatasheetpartid-255292-15139821.pdf?src-supplier=Verical; ComponentLink2Description: https://datasheet.ciiva.com/15139/getdatasheetpartid-255292-15139821.pdf?src-supplier=Verical
R43-R52 = ERJ-6GEY0R00V: RES SMD 0.0 OHM JUMPER 1/8W 0805; Manufacturer: Panasonic Electronic Components; Factory Stock: 0; Unit Price (USD): 0.00544; @ qty: 1500; Minimum Quantity: 1; Power (Watts): 0.125W, 1/8W; Part Number: ERJ-6GEY0R00V; Datasheets: http://industrial.panasonic.com/www-cgi/jvcr13pz.cgi?E+PZ+3+AOA0001+ERJ6GEY0R00V+7+WW; Image: //media.digikey.com/Renders/Panasonic%20Renders/ERJ-0805%20Pkg.jpg; Digi-Key Part Number: P0.0ACT-ND; Quantity Available: 1597627; Packaging: Cut Tape (CT); Series: ERJ; Part Status: Active; Value: 0.0; Tolerance: Jumper; Composition: Thick Film; Features: Automotive AEC-Q200; Temperature Coefficient: -; Operating Temperature: -55°C ~ 155°C; Package / Case: 0805 (2012 Metric); Supplier Device Package: 0805; Size / Dimension: 0.079" L x 0.049" W (2.00mm x 1.25mm); Height - Seated (Max): 0.028" (0.70mm); Number of Terminations: 2; Failure Rate: -
  R43-R46 R49: DNP: DNP
R53 R54 = ERJ-P06J103V: as R19 on sheet solenoid; Part Number: ERJ-P06J103V; Datasheets: https://industrial.panasonic.com/cdbs/www-data/pdf/RDA0000/AOA0000C243.pdf; Image: //media.digikey.com/Renders/Panasonic%20Renders/ERJ-0805%20Pkg.jpg; Digi-Key Part Number: P10KADCT-ND; Quantity Available: 413576; Packaging: Cut Tape (CT); Series: ERJ; Part Status: Active; Value: 10k; Tolerance: ±5%; Composition: Thick Film; Features: Automotive AEC-Q200, Pulse Withstanding; Operating Temperature: -55°C ~ 155°C; Package / Case: 0805 (2012 Metric); Supplier Device Package: 0805; Size / Dimension: 0.079" L x 0.049" W (2.00mm x 1.25mm); Height - Seated (Max): 0.028" (0.70mm); Number of Terminations: 2; Failure Rate: -
R55 R56 = ERJ-6GEYJ155V: as R21 on sheet solenoid; Part Number: ERJ-6GEYJ155V; Datasheets: http://industrial.panasonic.com/www-cgi/jvcr13pz.cgi?E+PZ+3+AOA0001+ERJ6GEYJ155V+7+WW; Image: //media.digikey.com/Renders/Panasonic%20Renders/ERJ-0805%20Pkg.jpg; Digi-Key Part Number: P1.5MACT-ND; Quantity Available: 51728; Packaging: Cut Tape (CT); Series: ERJ; Part Status: Active; Value: 1.5M; Tolerance: ±5%; Composition: Thick Film; Features: Automotive AEC-Q200; Operating Temperature: -55°C ~ 155°C; Package / Case: 0805 (2012 Metric); Supplier Device Package: 0805; Size / Dimension: 0.079" L x 0.049" W (2.00mm x 1.25mm); Height - Seated (Max): 0.028" (0.70mm); Number of Terminations: 2; Failure Rate: -
R57 R58 = ERJ-P06J104V: as R23 on sheet solenoid; Part Number: ERJ-P06J104V; Datasheets: https://industrial.panasonic.com/cdbs/www-data/pdf/RDA0000/AOA0000C243.pdf; Image: //media.digikey.com/Renders/Panasonic%20Renders/ERJ-0805%20Pkg.jpg; Digi-Key Part Number: P100KADCT-ND; Quantity Available: 82264; Packaging: Cut Tape (CT); Series: ERJ; Part Status: Active; Value: 100k; Tolerance: ±5%; Composition: Thick Film; Features: Automotive AEC-Q200, Pulse Withstanding; Operating Temperature: -55°C ~ 155°C; Package / Case: 0805 (2012 Metric); Supplier Device Package: 0805; Size / Dimension: 0.079" L x 0.049" W (2.00mm x 1.25mm); Height - Seated (Max): 0.028" (0.70mm); Number of Terminations: 2; Failure Rate: -
R59 R60 = ERJ-P06F2000V: as R25 on sheet solenoid; Part Number: ERJ-P06F2000V; Datasheets: https://industrial.panasonic.com/cdbs/www-data/pdf/RDA0000/AOA0000C243.pdf; Image: //media.digikey.com/Renders/Panasonic%20Renders/ERJ-0805%20Pkg.jpg; Digi-Key Part Number: P16064CT-ND; Quantity Available: 14258; Packaging: Cut Tape (CT); Series: ERJ; Part Status: Active; Value: 200; Tolerance: ±1%; Composition: Thick Film; Features: Automotive AEC-Q200, Pulse Withstanding; Operating Temperature: -55°C ~ 155°C; Package / Case: 0805 (2012 Metric); Supplier Device Package: 0805; Size / Dimension: 0.079" L x 0.049" W (2.00mm x 1.25mm); Height - Seated (Max): 0.028" (0.70mm); Number of Terminations: 2; Failure Rate: -
TP42-TP45 = TP: SMD TEST POINT
U12 = MCP23017T-E/SO: IC I/O EXPANDER I2C 16B 28SOIC; Manufacturer: Microchip; Manufacturer P/N: MCP23017T-E/SO; Digikey P/N: MCP23017T-E/SOCT-ND; Digikey Link: https://www.digikey.com/product-detail/en/microchip-technology/MCP23017T-E-SO/MCP23017T-E-SOCT-ND/5358289